# EAGLE design gatedriver_trafo_sma_compact_ACDC_ultra_options (EAGLE 7.2.0)
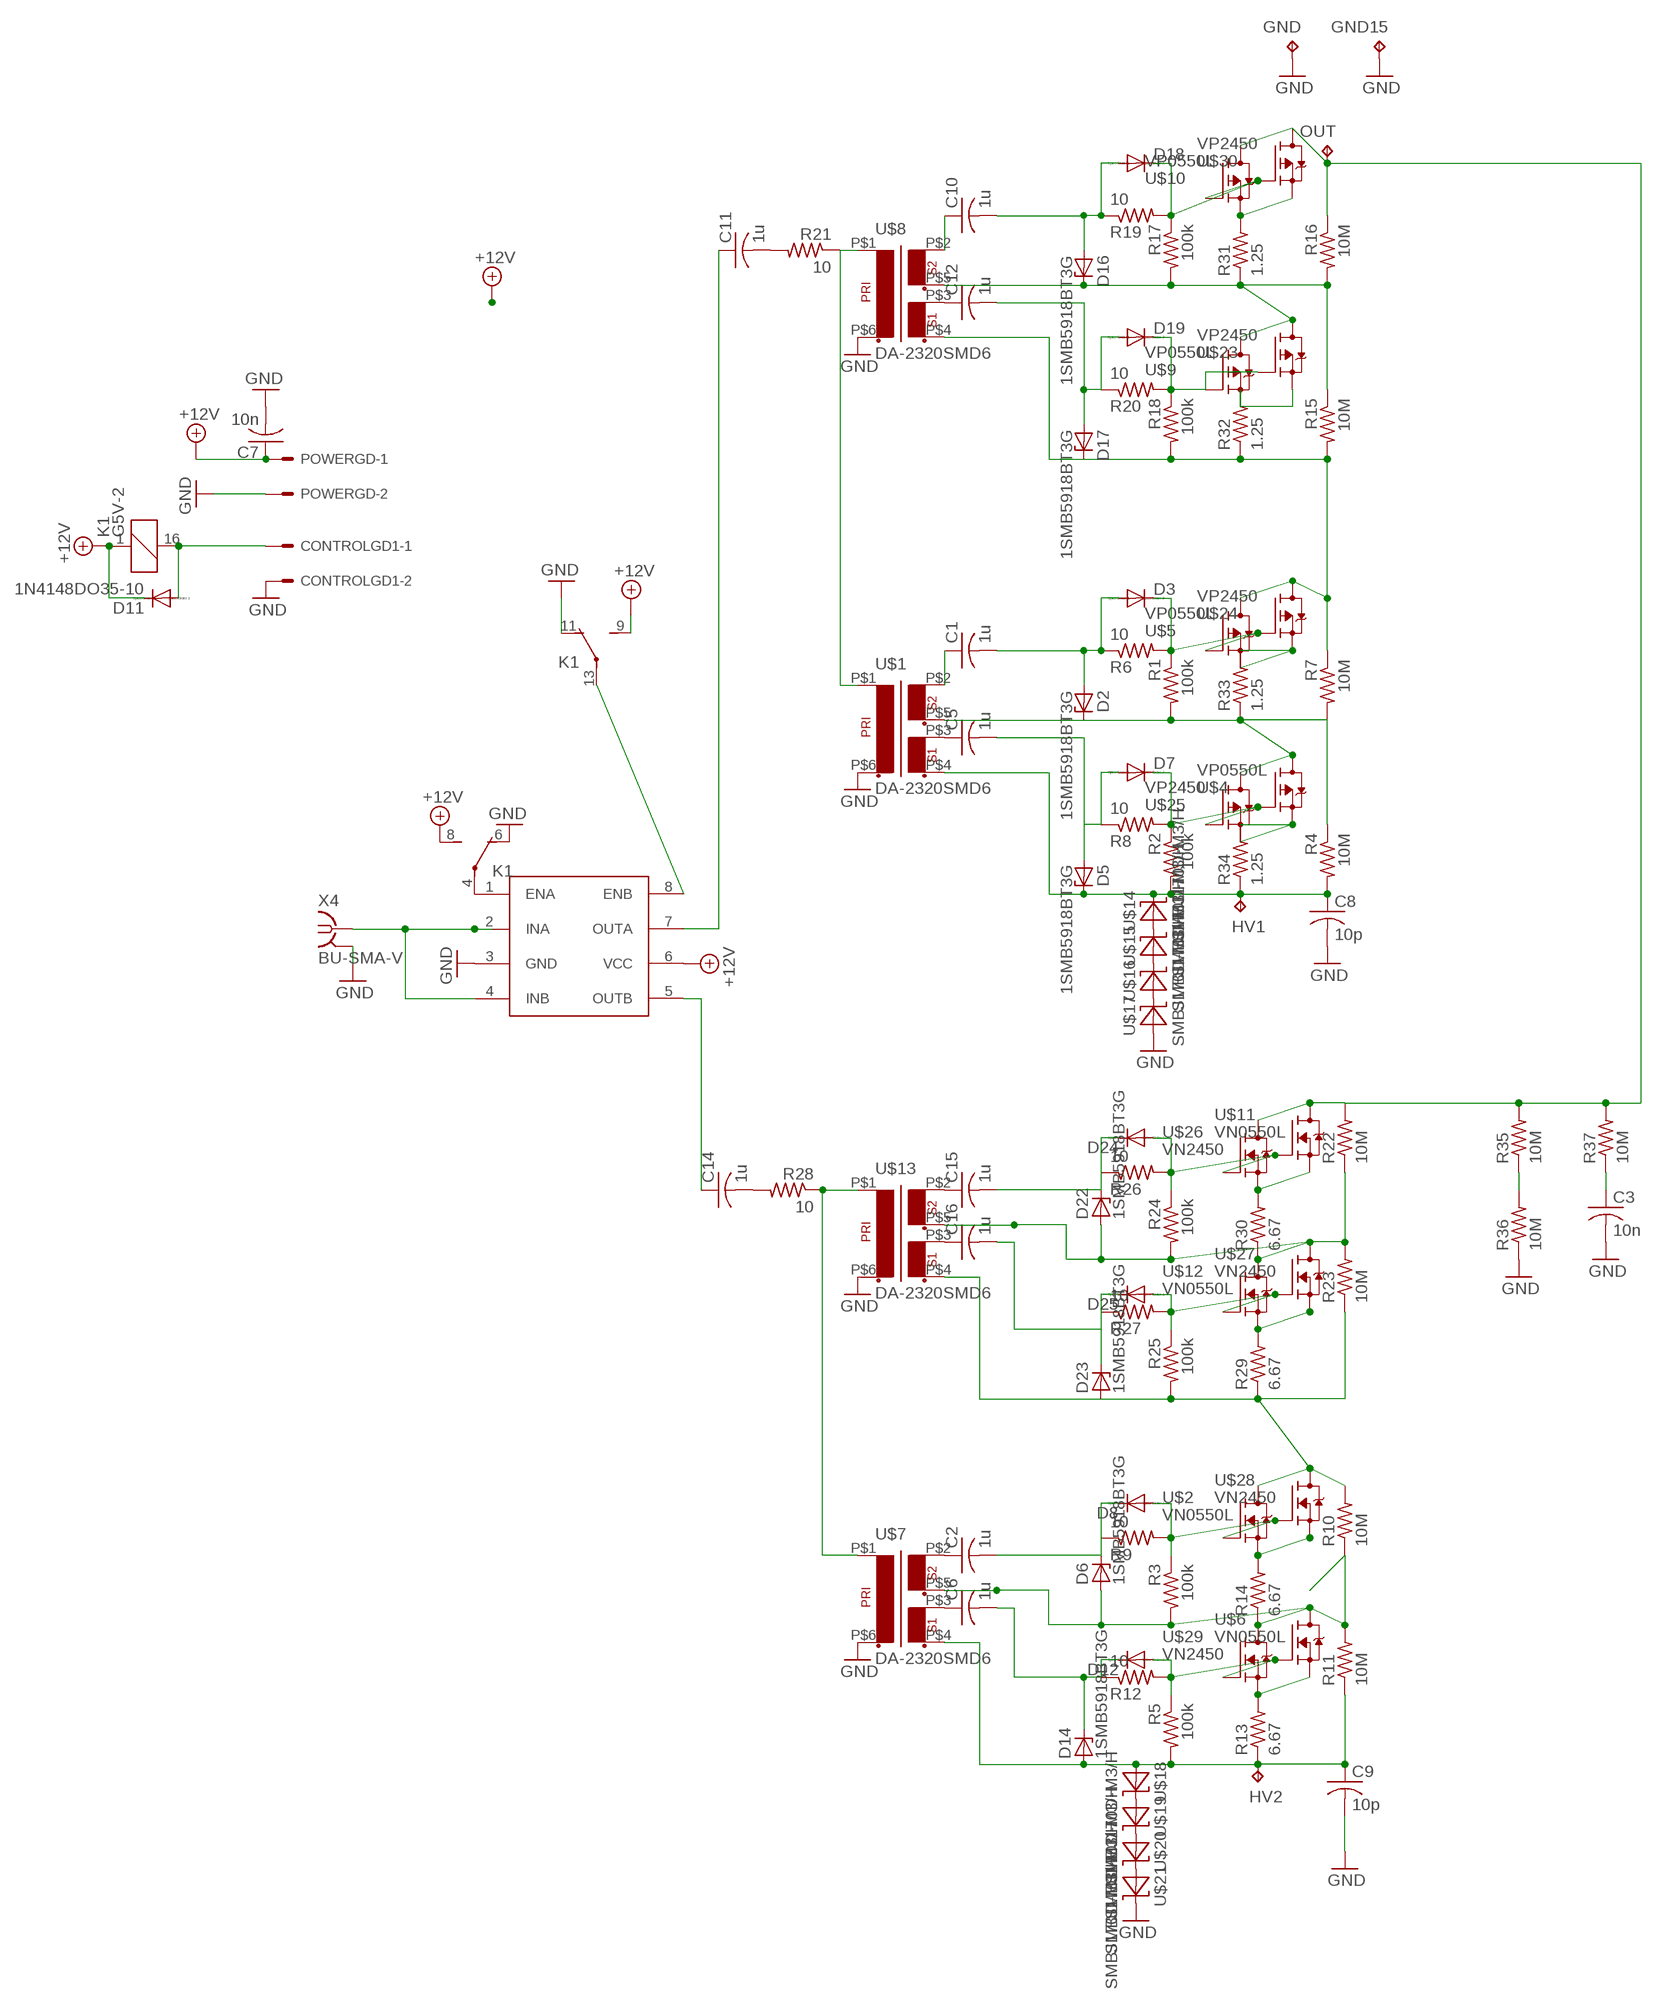
[diagram p0: schematic, sheet 1]

## Parts
C1  1u  C-USC0805  [C0805]
C2  1u  C-USC0805  [C0805]
C3  10n  C-USC0805  [C0805]
C5  1u  C-USC0805  [C0805]
C6  1u  C-USC0805  [C0805]
C7  10n  C-US050-030X075  [C050-030X075]
C8  10p  C-US102-064X133  [C102-064X133]
C9  10p  C-US102-064X133  [C102-064X133]
C10  1u  C-USC0805  [C0805]
C11  1u  C-USC0805  [C0805]
C12  1u  C-USC0805  [C0805]
C14  1u  C-USC0805  [C0805]
C15  1u  C-USC0805  [C0805]
C16  1u  C-USC0805  [C0805]
CONTROLGD1  KK-156-2  [KK-156-2]
D2  1SMB5918BT3G  ZENER-DIODESMB  [SMB]
D3  DIODE-SMB  [SMB]
D5  1SMB5918BT3G  ZENER-DIODESMB  [SMB]
D6  1SMB5918BT3G  ZENER-DIODESMB  [SMB]
D7  DIODE-SMB  [SMB]
D8  DIODE-SMB  [SMB]
D11  1N4148DO35-10  [DO35-10]
D12  DIODE-SMB  [SMB]
D14  1SMB5918BT3G  ZENER-DIODESMB  [SMB]
D16  1SMB5918BT3G  ZENER-DIODESMB  [SMB]
D17  1SMB5918BT3G  ZENER-DIODESMB  [SMB]
D18  DIODE-SMB  [SMB]
D19  DIODE-SMB  [SMB]
D22  1SMB5918BT3G  ZENER-DIODESMB  [SMB]
D23  1SMB5918BT3G  ZENER-DIODESMB  [SMB]
D24  DIODE-SMB  [SMB]
D25  DIODE-SMB  [SMB]
GND  TPPAD1-20Y  [P1-20Y]
GND15  TPPAD1-20Y  [P1-20Y]
HV1  TPPAD1-20Y  [P1-20Y]
HV2  TPPAD1-20Y  [P1-20Y]
K1  G5V-2  [G5V-2]
OUT  TPPAD1-20Y  [P1-20Y]
POWERGD  KK-156-2  [KK-156-2]
R1  100k  R-US_R0805  [R0805]
R2  100k  R-US_R0805  [R0805]
R3  100k  R-US_R0805  [R0805]
R4  10M  R-US_R2512  [R2512]
R5  100k  R-US_R0805  [R0805]
R6  10  R-US_R0805  [R0805]
R7  10M  R-US_R2512  [R2512]
R8  10  R-US_R0805  [R0805]
R9  10  R-US_R0805  [R0805]
R10  10M  R-US_R2512  [R2512]
R11  10M  R-US_R2512  [R2512]
R12  10  R-US_R0805  [R0805]
R13  6.67  R-US_R0805  [R0805]
R14  6.67  R-US_R0805  [R0805]
R15  10M  R-US_R2512  [R2512]
R16  10M  R-US_R2512  [R2512]
R17  100k  R-US_R0805  [R0805]
R18  100k  R-US_R0805  [R0805]
R19  10  R-US_R0805  [R0805]
R20  10  R-US_R0805  [R0805]
R21  10  R-US_R0805  [R0805]
R22  10M  R-US_R2512  [R2512]
R23  10M  R-US_R2512  [R2512]
R24  100k  R-US_R0805  [R0805]
R25  100k  R-US_R0805  [R0805]
R26  10  R-US_R0805  [R0805]
R27  10  R-US_R0805  [R0805]
R28  10  R-US_R0805  [R0805]
R29  6.67  R-US_R0805  [R0805]
R30  6.67  R-US_R0805  [R0805]
R31  1.25  R-US_R0805  [R0805]
R32  1.25  R-US_R0805  [R0805]
R33  1.25  R-US_R0805  [R0805]
R34  1.25  R-US_R0805  [R0805]
R35  10M  R-US_R2512  [R2512]
R36  10M  R-US_R2512  [R2512]
R37  10M  R-US_R2512  [R2512]
U$1  DA-2320SMD6  [SMD6]
U$2  VN0550L  [TO92L]
U$3  UCC27425  [DIL08]
U$4  VP0550L  [TO92L]
U$5  VP0550L  [TO92L]
U$6  VN0550L  [TO92L]
U$7  DA-2320SMD6  [SMD6]
U$8  DA-2320SMD6  [SMD6]
U$9  VP0550L  [TO92L]
U$10  VP0550L  [TO92L]
U$11  VN0550L  [TO92L]
U$12  VN0550L  [TO92L]
U$13  DA-2320SMD6  [SMD6]
U$14  SMBJ170D-M3/H  [DO214AA]
U$15  SMBJ170D-M3/H  [DO214AA]
U$16  SMBJ170D-M3/H  [DO214AA]
U$17  SMBJ170D-M3/H  [DO214AA]
U$18  SMBJ170D-M3/H  [DO214AA]
U$19  SMBJ170D-M3/H  [DO214AA]
U$20  SMBJ170D-M3/H  [DO214AA]
U$21  SMBJ170D-M3/H  [DO214AA]
U$23  VP2450  [SOT89-BCE]
U$24  VP2450  [SOT89-BCE]
U$25  VP2450  [SOT89-BCE]
U$26  VN2450  [SOT89-BCE]
U$27  VN2450  [SOT89-BCE]
U$28  VN2450  [SOT89-BCE]
U$29  VN2450  [SOT89-BCE]
U$30  VP2450  [SOT89-BCE]
X4  BU-SMA-V  [BU-SMA-V]

## Nets
+15V: C7.1 D11.C K1.1 K1.8(1:S) K1.9(2:S) POWERGD.1 U$3.6(VCC) ; supply symbol labelled +12V
ENSW: CONTROLGD1.1 D11.A K1.16
GND: C3.2 C7.2 C8.2 C9.2 CONTROLGD1.2 GND15.TP GND.TP K1.6(1:O) K1.11(2:O) POWERGD.2 R36.1 U$1.P$6 U$3.3(GND) U$7.P$6 U$8.P$6 U$13.P$6 U$17.A U$21.C X4.2 X4.3 X4.4 X4.5
N$1: U$3.2(INA) U$3.4(INB) X4.1
N$2: C11.1 U$3.7(OUTA)
N$3: R13.2 U$6.3(S) U$29.E(S)
N$4: C14.1 U$3.5(OUTB)
N$5: C1.1 U$1.P$2
N$6: R14.2 U$2.3(S) U$28.E(S)
N$7: C5.1 U$1.P$3
N$8: D3.C R1.1 R6.2 U$5.2(G) U$24.B(G)
N$9: R29.2 U$12.3(S) U$27.E(S)
N$10: C1.2 D2.A D3.A R6.1
N$11: D12.A R5.1 R12.2 U$6.2(G) U$29.B(G)
N$12: D7.C R2.1 R8.2 U$4.2(G) U$25.B(G)
N$13: D6.A R3.2 R10.1 R11.2 R14.1 U$6.1(D) U$7.P$5 U$29.C(D) U$29.C@1(D)
N$14: K1.4(1:P) U$3.1(ENA)
N$15: K1.13(2:P) U$3.8(ENB)
N$16: C5.2 D5.A D7.A R8.1
N$17: C8.1 D5.C HV1.TP R2.2 R4.2 R34.1 U$1.P$4 U$14.C
N$18: D2.C R1.2 R4.1 R7.2 R33.1 U$1.P$5 U$4.1(D) U$25.C(D) U$25.C@1(D)
N$19: R30.2 U$11.3(S) U$26.E(S)
N$20: R34.2 U$4.3(S) U$25.E(S)
N$21: R33.2 U$5.3(S) U$24.E(S)
N$22: C2.1 U$7.P$2
N$23: C6.1 U$7.P$3
N$24: C9.1 D14.A HV2.TP R5.2 R11.1 R13.1 U$7.P$4 U$18.A
N$25: C2.2 D6.C D8.C R9.1
N$26: OUT.TP R16.1 R22.2 R35.2 R37.2 U$10.1(D) U$11.1(D) U$26.C(D) U$26.C@1(D) U$30.C(D) U$30.C@1(D)
N$27: C6.2 D12.C D14.C R12.1
N$28: C10.1 U$8.P$2
N$29: C12.1 U$8.P$3
N$30: C12.2 D17.A D19.A R20.1
N$31: R31.2 U$10.3(S) U$30.E(S)
N$32: D17.C R7.1 R15.2 R18.2 R32.1 U$5.1(D) U$8.P$4 U$24.C(D) U$24.C@1(D)
N$33: D16.C R15.1 R16.2 R17.2 R31.1 U$8.P$5 U$9.1(D) U$23.C(D) U$23.C@1(D)
N$34: D18.C R17.1 R19.2 U$10.2(G) U$30.B(G)
N$35: C10.2 D16.A D18.A R19.1
N$36: D19.C R18.1 R20.2 U$9.2(G) U$23.B(G)
N$37: R21.1 U$1.P$1 U$8.P$1
N$38: C11.2 R21.2
N$39: R32.2 U$9.3(S) U$23.E(S)
N$40: C15.1 U$13.P$2
N$41: C16.1 U$13.P$3
N$42: C15.2 D22.C D24.C R26.1
N$43: C16.2 D23.C D25.C R27.1
N$44: R35.1 R36.2
N$45: C3.1 R37.1
N$46: D22.A R22.1 R23.2 R24.2 R30.1 U$12.1(D) U$13.P$5 U$27.C(D) U$27.C@1(D)
N$47: D25.A R25.1 R27.2 U$12.2(G) U$27.B(G)
N$48: R28.1 U$7.P$1 U$13.P$1
N$49: C14.2 R28.2
N$50: D24.A R24.1 R26.2 U$11.2(G) U$26.B(G)
N$51: D23.A R10.2 R23.1 R25.2 R29.1 U$2.1(D) U$13.P$4 U$28.C(D) U$28.C@1(D)
N$52: U$14.A U$15.C
N$53: U$15.A U$16.C
N$54: U$16.A U$17.C
N$55: U$18.C U$19.A
N$56: U$19.C U$20.A
N$57: U$20.C U$21.A
N$251: D8.A R3.1 R9.2 U$2.2(G) U$28.B(G)

## Library data of the parts
C1-C3 C5 C6 C8-C12 C14-C16 = resistor:C-US: CAPACITOR, American symbol
C7 = rcl:C-US: CAPACITOR, American symbol
CONTROLGD1 POWERGD = con-molex:KK-156-2: KK 156 HEADER Source: http://www.molex.com/pdm_docs/sd/026604100_sd.pdf; OC_FARNELL: unknown; OC_NEWARK: unknown
D2 D5 D6 D14 D16 D17 D22 D23 = diode:ZENER-DIODE: Z-Diode
D3 D7 D8 D12 D18 D19 D24 D25 = diode:DIODE-: DIODE
D11 = diode:1N4148: DIODE high speed (Philips)
GND GND15 HV1 HV2 OUT = testpad:TP: Test pad
K1 = relay:G5V-2: OMRON PCB Relay Source: http://www.omron.com/ecb/products/pdf/en-g5v2.pdf; MPN: G5V-2 5DC; OC_FARNELL: 9949488; OC_NEWARK: 78K5703
R1-R37 = rcl:R-US_: RESISTOR, American symbol
U$1 U$7 U$8 U$13 = trafo:DA-2320
U$2 U$6 U$11 U$12 = transistor-fet:VN0550
U$3 = texas:UCC27425
U$4 U$5 U$9 U$10 = transistor-fet:VP0550
U$14-U$21 = diode:SMBJ170D-M3/H
U$23-U$25 U$30 = transistor-fet:VP2450
U$26-U$29 = transistor-fet:VN2450
X4 = con-coax:BU-SMA-V: FEMALE SMA CONNECTOR Radiall distributor RS 112-3794; OC_FARNELL: unknown; OC_NEWARK: unknown

## Board
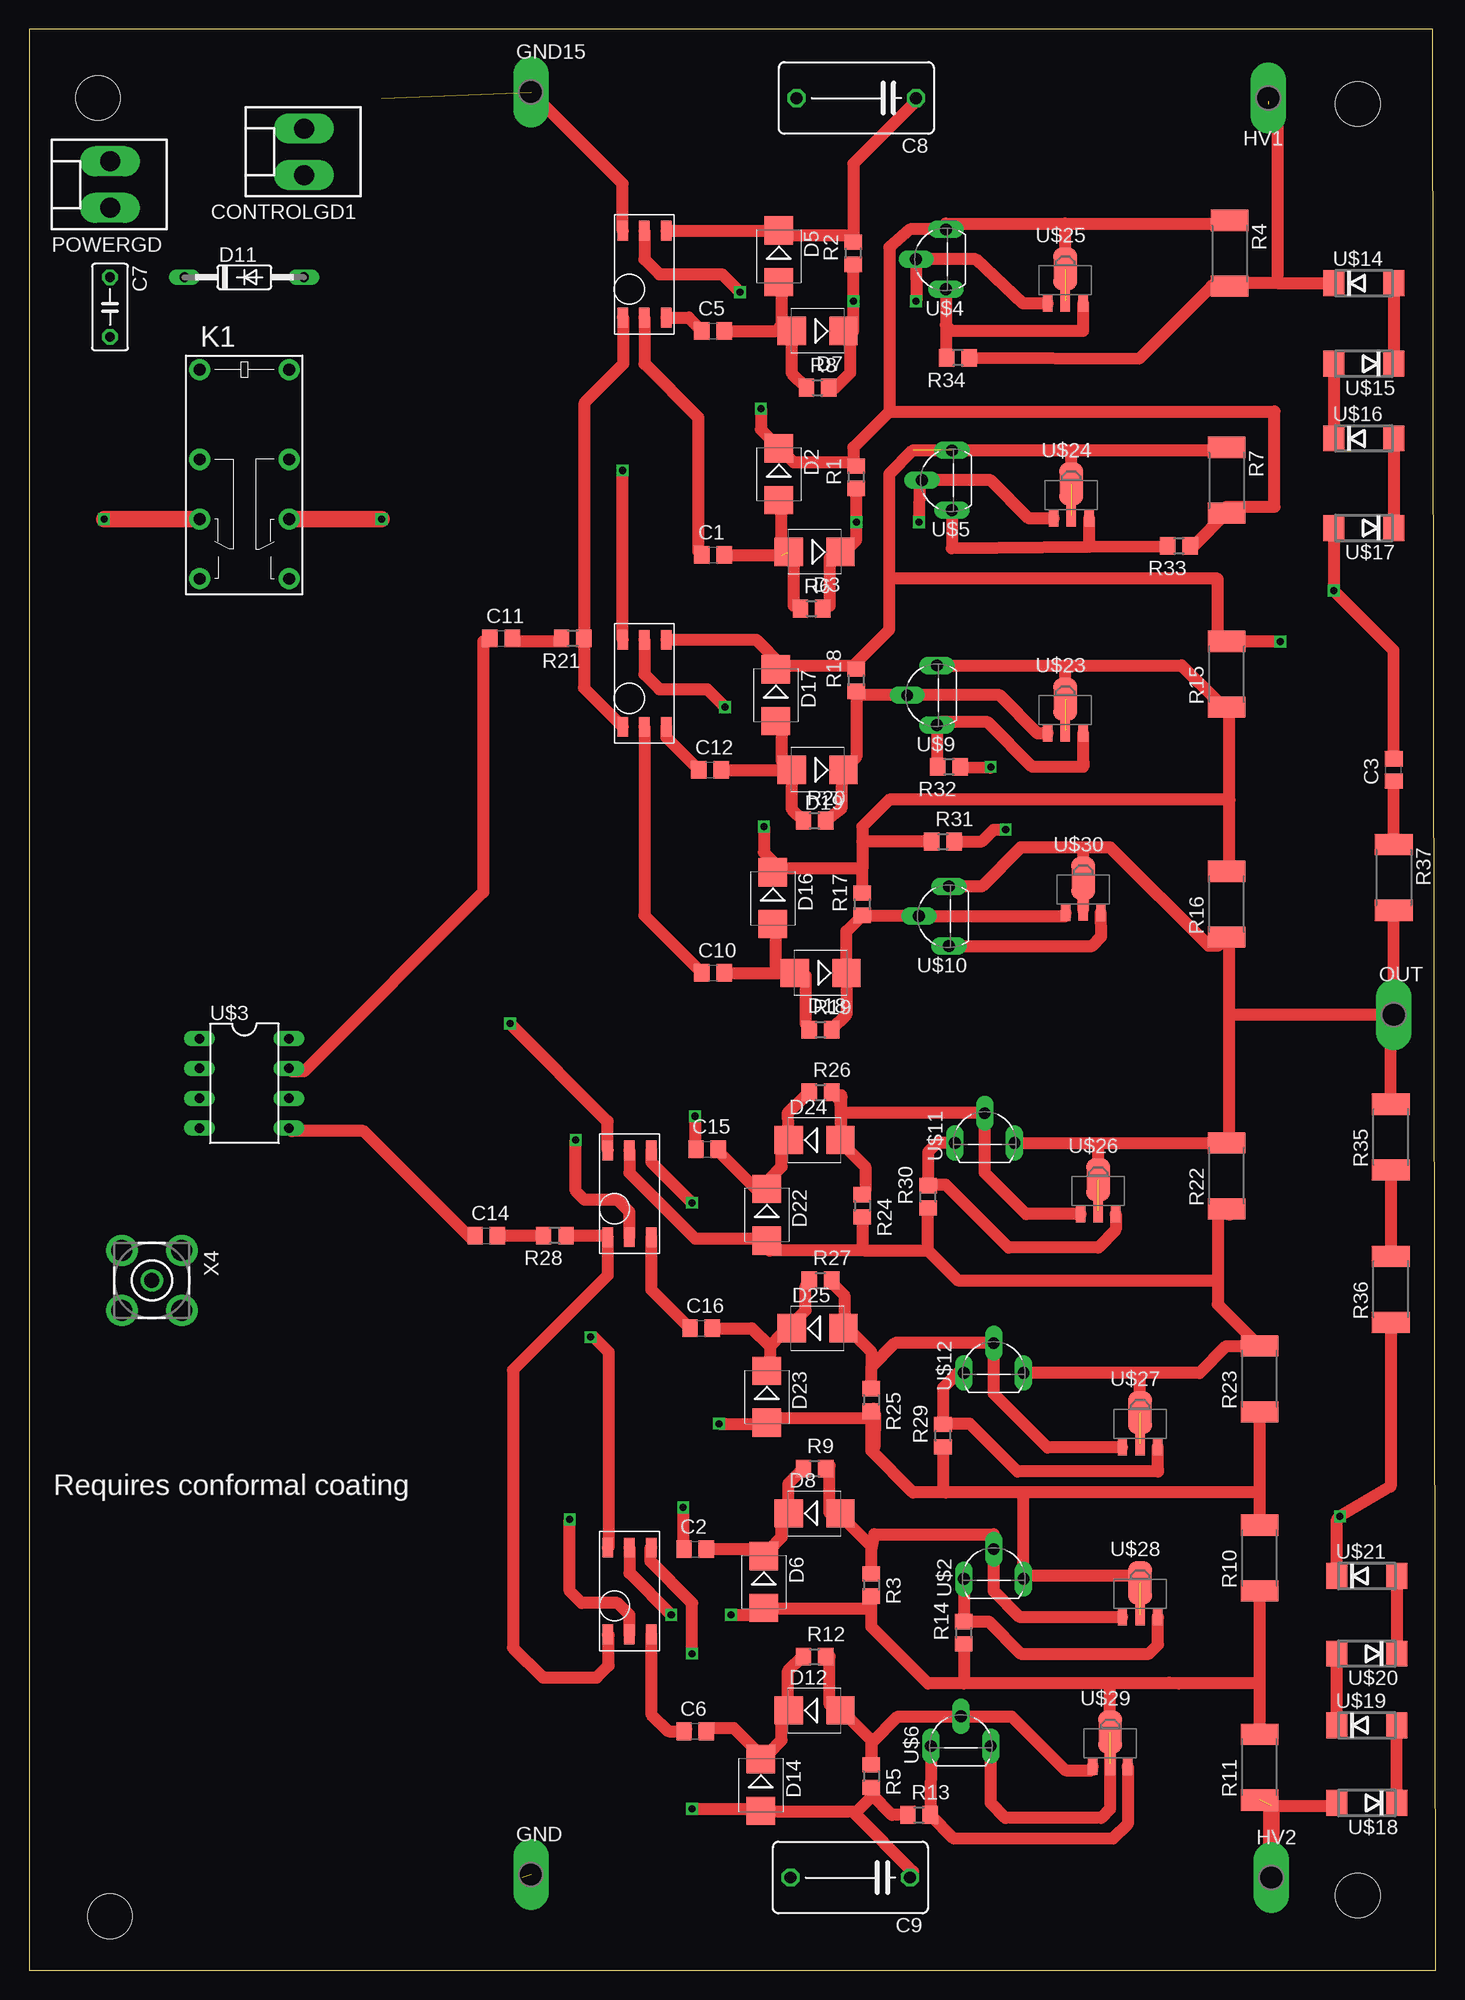
[diagram p1: board, top side]
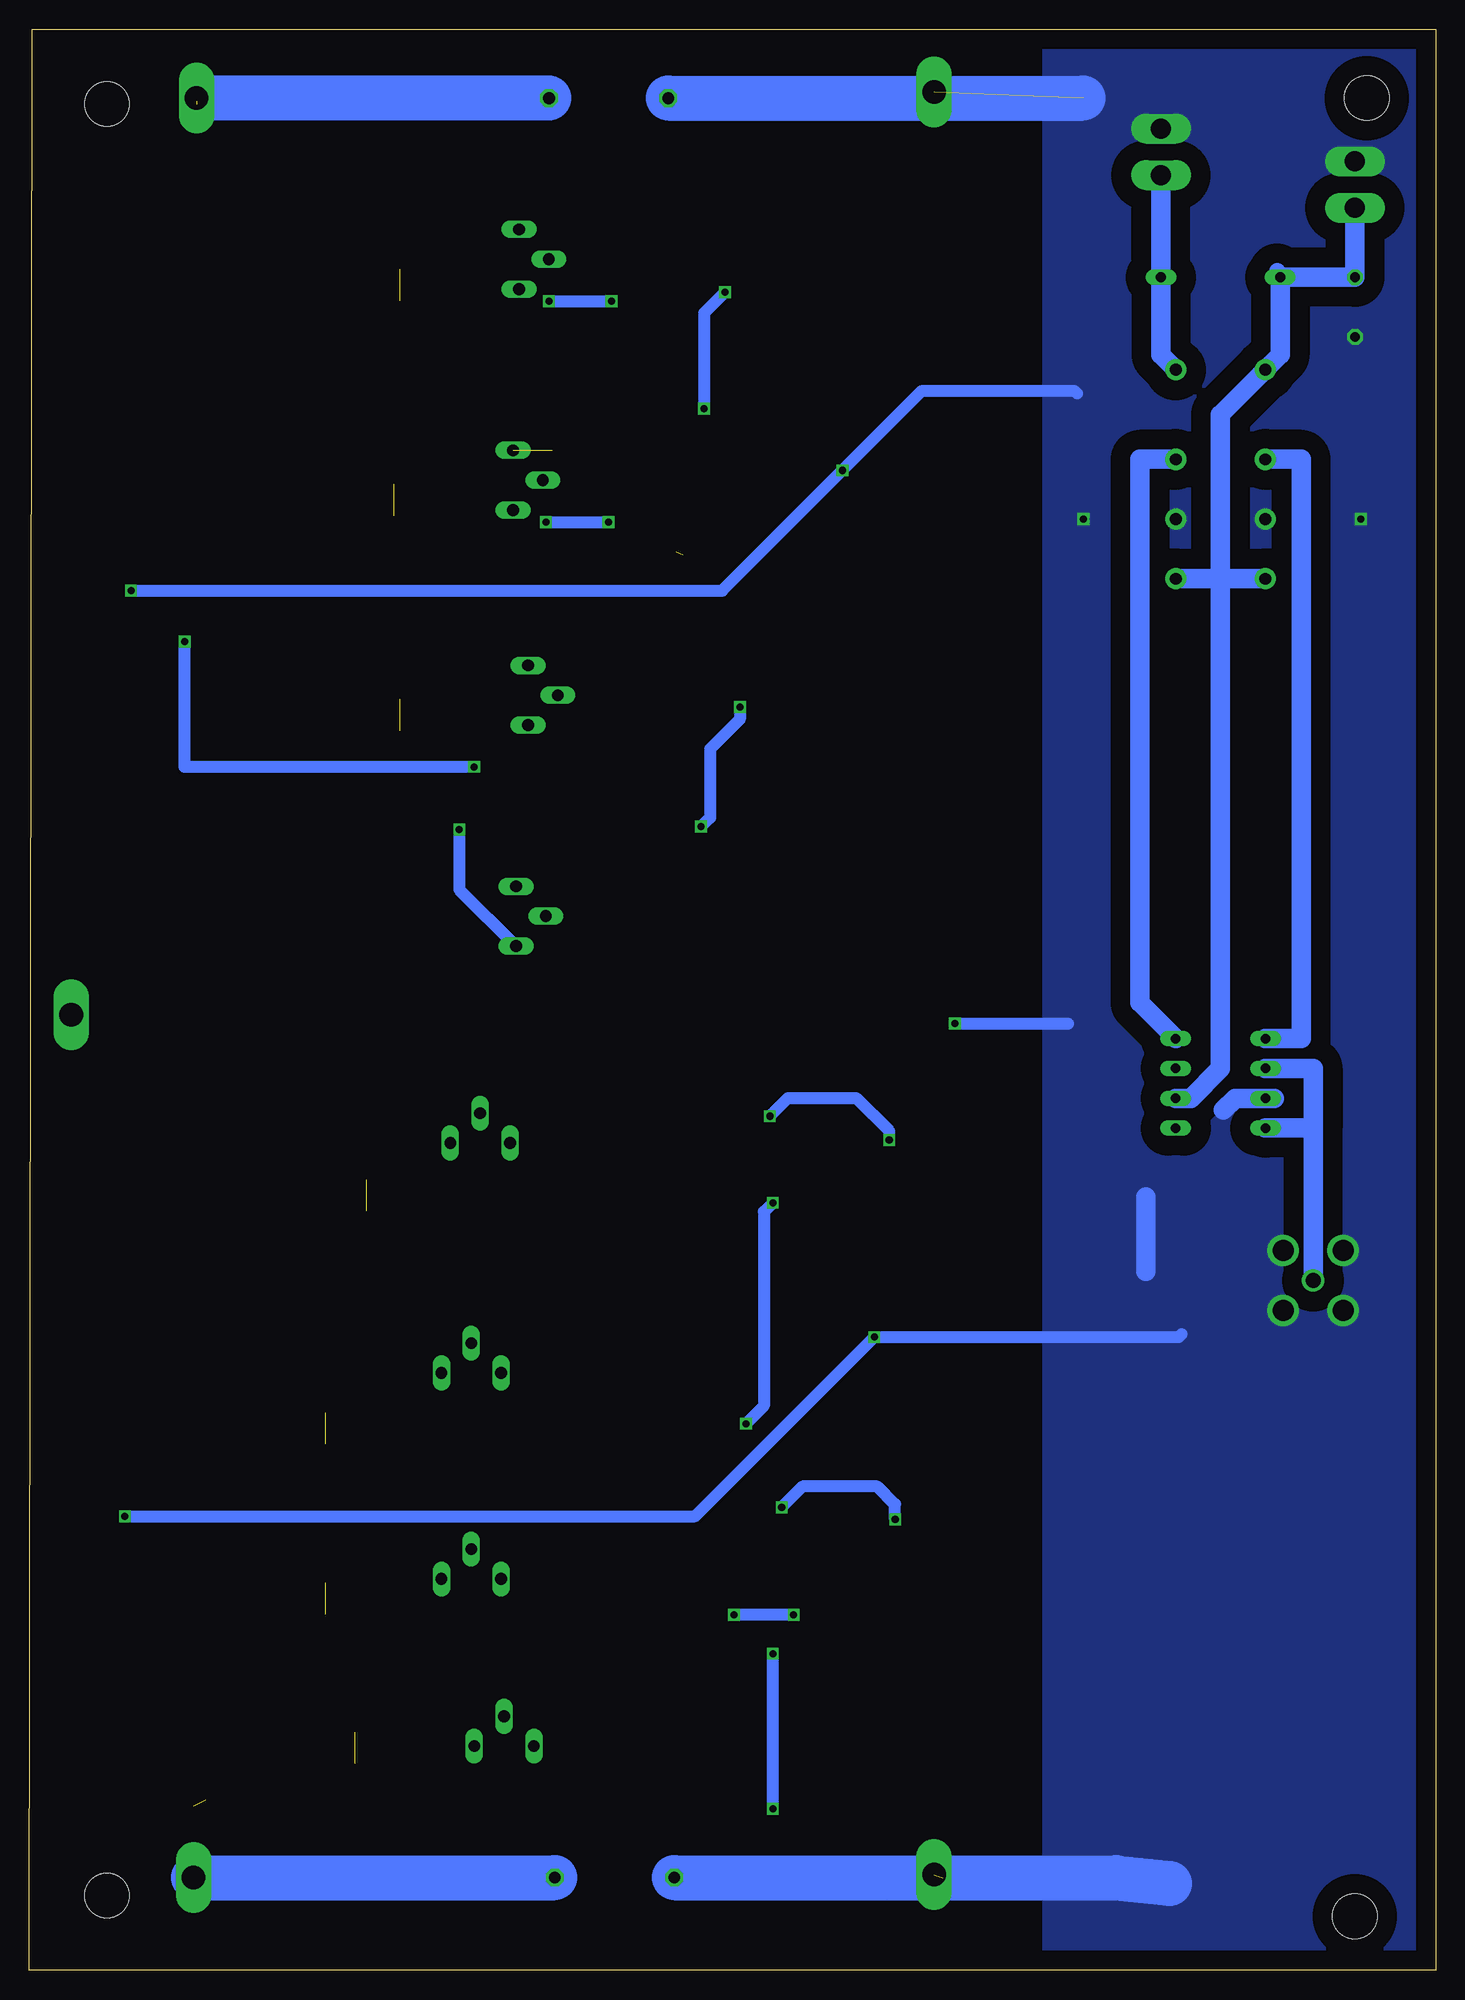
[diagram p2: board, bottom side, seen from below]

Size 119.63 x 165.1 mm. Coordinates in mm from the lower left corner, seen from the top.
Outline: 0,0 119.63,0 119.38,165.1 0,165.1 0,0
Copper layers (1*16): Top 0.035mm / dielectric 1.5mm / Bottom 0.035mm
Design rules "default *": minimum track width 6mil, minimum drill 15mil, track to track 6mil, track to pad 6mil, pad to pad 6mil, via to via 6mil, smd to smd 6mil, copper to edge 40mil, drill to drill 8mil, minimum pad ring 10mil, minimum via ring 8mil, stop-mask expansion 4mil, vias tented up to drill 0mil, thermal gap 10mil
Holes 3.8 mm at 113.03,158.75 113.03,6.35 6.86,4.57 5.84,159.26

### Footprints (pad centres in the part's own frame; a part is rotated, then mirrored left to right if it is on the bottom)
C0805 = smd 1.3 x 1.5: 1 -0.95,0; 2 0.95,0
C050-030X075 = drill 0.813 octagon: 1 -2.54,0; 2 2.54,0
C102-064X133 = drill 1.016 octagon: 1 -5.08,0; 2 5.08,0
KK-156-2 = drill 1.7 pad 2.184 long: 1 -1.98,0; 2 1.98,0
SMB = smd 2.4 x 2.4: A 2.2,0; C -2.2,0
DO35-10 = drill 0.813 long: A 5.08,0; C -5.08,0
P1-20Y = drill 2.007 pad 2.54 long: TP 0,0
G5V-2 = drill 1 pad 1.8: 1 -8.89,-3.81; 4 -1.27,-3.81; 6 3.81,-3.81; 8 8.89,-3.81; 9 8.89,3.81; 11 3.81,3.81; 13 -1.27,3.81; 16 -8.89,3.81
R0805 = smd 1.3 x 1.5: 1 -0.95,0; 2 0.95,0
R2512 = smd 1.8 x 3.2: 1 -2.8,0; 2 2.8,0
SMD6 = smd 1.676 x 0.889: P$1 -3.696,1.854; P$2 -3.696,0; P$3 -3.696,-1.854; P$4 3.696,-1.854; P$5 3.696,0; P$6 3.696,1.854
TO92L = drill 1 long: 1 0,-2.54; 2 2.54,0; 3 0,2.54
DIL08 = drill 0.813 long: 1 -3.81,-3.81; 2 -1.27,-3.81; 3 1.27,-3.81; 4 3.81,-3.81; 5 3.81,3.81; 6 1.27,3.81; 7 -1.27,3.81; 8 -3.81,3.81
DO214AA = smd 1.8 x 2.2: A 2.55,0; C -2.55,0
SOT89-BCE = smd 0.8 x 1.4: B -1.499,-1.981; E 1.499,-1.981 | smd 0.8 x 1.9: C 0,-1.727 | smd 2.032 x 3.65: C@1 0,0.94
BU-SMA-V = drill 1.27: 1 0,0 | drill 1.778: 2 -2.55,2.55; 3 2.55,2.55; 4 2.55,-2.55; 5 -2.55,-2.55

### Placement (x,y rotation side)
C1  58.17,120.4 0 top
C2  56.64,35.81 0 top
C3  116.08,102.11 90 top
C5  58.17,139.45 0 top
C6  56.64,20.32 0 top
C7  6.86,141.48 270 top
C8  70.36,159.26 180 top
C9  69.85,7.87 180 top
C10  58.17,84.84 0 top
C11  40.13,113.28 0 top
C12  57.91,102.11 0 top
C14  38.86,62.48 0 top
C15  57.66,69.85 0 top
C16  57.15,54.61 0 top
CONTROLGD1  23.37,154.69 90 top
D2  63.75,127.25 270 top
D3  66.8,120.65 180 top
D5  63.75,145.8 270 top
D6  62.48,33.02 270 top
D7  67.06,139.45 180 top
D8  66.8,38.86 0 top
D11  18.29,144.02 0 top
D12  66.8,22.1 0 top
D14  62.23,15.75 270 top
D16  63.25,91.19 270 top
D17  63.5,108.46 270 top
D18  67.31,84.84 180 top
D19  67.06,102.11 180 top
D22  62.74,64.26 270 top
D23  62.74,48.77 270 top
D24  66.8,70.61 0 top
D25  67.06,54.61 0 top
GND  42.67,8.13 0 top
GND15  42.67,159.77 0 top
HV1  105.41,159.26 180 top
HV2  105.66,7.87 0 top
K1  18.29,127.25 270 top
OUT  116.08,81.28 0 top
POWERGD  6.86,151.89 90 top
R1  70.36,127 90 top
R2  70.1,146.05 90 top
R3  71.63,32.77 270 top
R4  102.11,146.05 270 top
R5  71.63,16.51 270 top
R6  66.55,115.82 0 top
R7  101.85,126.75 270 top
R8  67.06,134.62 0 top
R9  66.8,42.67 0 top
R10  104.65,35.05 90 top
R11  104.65,17.27 90 top
R12  66.8,26.67 0 top
R13  75.69,13.21 0 top
R14  79.5,28.7 90 top
R15  101.85,110.24 90 top
R16  101.85,90.68 90 top
R17  70.87,90.68 90 top
R18  70.36,109.73 90 top
R19  67.31,80.01 0 top
R20  66.8,97.79 0 top
R21  46.23,113.28 180 top
R22  101.85,67.56 90 top
R23  104.65,50.29 90 top
R24  70.87,65.02 270 top
R25  71.63,48.51 270 top
R26  67.31,74.68 0 top
R27  67.31,58.67 0 top
R28  44.7,62.48 180 top
R29  77.72,45.47 90 top
R30  76.45,65.79 90 top
R31  77.72,96.01 0 top
R32  78.23,102.36 180 top
R33  97.79,121.16 180 top
R34  78.99,137.16 180 top
R35  115.82,70.87 90 top
R36  115.82,57.91 90 top
R37  116.08,92.96 270 top
U$1  52.32,144.27 90 top
U$2  82.04,33.27 90 top
U$3  18.29,75.44 270 top
U$4  77.98,145.54 180 top
U$5  78.49,126.75 180 top
U$6  79.25,19.05 90 top
U$7  51.05,32.26 90 top
U$8  52.32,109.47 90 top
U$9  77.22,108.46 180 top
U$10  78.23,89.66 180 top
U$11  81.28,70.36 90 top
U$12  82.04,50.8 90 top
U$13  51.05,66.04 90 top
U$14  113.54,143.51 0 top
U$15  113.54,136.65 180 top
U$16  113.54,130.3 0 top
U$17  113.54,122.68 180 top
U$18  113.79,14.22 180 top
U$19  113.79,20.83 0 top
U$20  113.79,26.92 180 top
U$21  113.79,33.53 0 top
U$23  88.14,107.19 0 top
U$24  88.65,125.48 0 top
U$25  88.14,143.76 0 top
U$26  90.93,66.29 0 top
U$27  94.49,46.48 0 top
U$28  94.49,32 0 top
U$29  91.95,19.3 0 top
U$30  89.66,91.95 0 top
X4  10.41,58.67 270 top

### Tracks (layer width: path | path; a pad name or v marks a point on that pad's centre or on a via)
+15V
  Bottom 1.016: 13.21,144.53 D11.C
  Bottom 1.422: 13.46,144.02 13.46,144.53
  Bottom 1.676: D11.C 13.21,137.41 K1.1 18.29,132.33 18.29,118.36 | 18.29,118.36 18.29,76.71 20.83,74.17 U$3.6 | 18.29,118.36 K1.9 | K1.8 18.29,118.36 | POWERGD.1 C7.1 D11.C | D11.C 13.46,144.02
ENSW
  Bottom 1.676: CONTROLGD1.1 D11.A 23.37,137.41 K1.16
GND  (via drill 0.6)  (2 unrouted)
  Top 1.016: v47.75,53.85 48.01,53.85 49.28,52.58 49.28,36.03 U$7.P$6 | U$1.P$6 50.47,151.97 GND15.TP | U$8.P$6 v50.47,127.58 | U$13.P$6 49.2,72.21 v40.89,80.52 | 111.25,33.54 U$21.C 111.24,38.34 v111.51,38.61 115.82,41.15 R36.1 | U$17.A v110.99,117.36 116.08,112.27 C3.2
  Top 1.422: K1.6 v6.35,123.44 | K1.11 v29.97,123.44
  Bottom 1.016: 15.24,74.17 15.24,74.42 U$3.3 | 21.59,54.1 21.84,53.85 v47.75,53.85 62.99,38.61 v111.51,38.61 | 30.48,134.11 30.73,134.37 43.69,134.37 v50.47,127.58 60.71,117.35 106.17,117.35 v110.99,117.36 | v40.89,80.52 31.24,80.52
  Bottom 1.422: 41.66,8.13 41.91,7.87
  Bottom 1.676: 24.64,65.79 24.64,59.44 | 18.03,73.15 17.02,74.17 15.24,74.17 U$3.3 13.72,74.17
  Bottom 3.81: 46.69,7.82 27.18,7.85 | 27.18,7.85 22.61,7.37 | C8.2 29.97,159.26 | C9.2 41.91,7.87 27.18,7.87 27.18,7.85
  pour Bottom (isolate 1.676, no thermals): 0,165.1 33.27,165.1 33.27,0 0,0
N$1
  Bottom 1.676: X4.1 10.41,71.63 | U$3.2 10.41,76.71 10.41,71.63 | 10.41,71.63 U$3.4
N$2
  Top 1.016: U$3.7 22.35,76.45 23.37,76.45 38.61,91.69 38.61,113.03 C11.1
N$3
  Top 1.016: U$6.3 R13.2 78.67,11.18 92.2,11.18 93.45,12.42 U$29.E
N$4
  Top 1.016: U$3.5 22.35,71.37 28.45,71.37 37.59,62.23 C14.1
N$5
  Top 1.016: U$1.P$2 52.32,136.65 56.9,132.08 56.9,120.72 C1.1
N$6
  Top 1.016: U$2.3 R14.2 81.6,29.65 84.33,26.92 95.25,26.92 96.01,27.69 96.01,30 U$28.E
N$7
  Top 1.016: U$1.P$3 56.09,140.58 C5.1
N$8  (via drill 0.6)
  Top 1.016: R6.2 68.07,116.08 68.07,120.14 D3.C 69.34,120.65 70.36,121.67 v70.36,123.19 R1.1 | v75.69,123.19 75.72,126.77 U$5.2 81.79,126.75 85.04,123.5 U$24.B
  Bottom 1.016: v75.69,123.19 v70.36,123.19
N$9
  Top 1.016: U$12.3 78.99,50.8 77.72,49.53 R29.2 77.79,46.48 80.01,46.48 84.07,42.42 96.01,42.42 95.99,42.95 U$27.E
N$10  (1 unrouted)
  Top 1.016: R6.1 65.02,116.08 65.02,120.14 D3.A 64.01,121.16 64.01,124.21 D2.A | C1.2 64.01,120.4
N$11
  Top 1.016: R12.2 68.07,26.67 68.07,22.61 D12.A 69.09,22.1 71.63,19.56 R5.1 71.63,19.3 73.91,21.59 U$6.2 83.57,21.59 88.14,17.02 90.4,17.02 U$29.B
N$12  (via drill 0.6)
  Top 1.016: R2.1 v70.1,141.99 70.1,139.45 69.85,139.45 | 69.85,139.45 D7.C | R8.2 68.58,134.62 69.85,135.89 69.85,139.45 | v75.44,141.99 75.46,142.01 U$4.2 80.52,145.54 84.53,141.78 U$25.B
  Bottom 1.016: v75.44,141.99 v70.1,141.99
N$13  (via drill 0.6)  (1 unrouted)
  Top 1.016: 71.63,30.73 62.74,30.73 D6.A 62.65,30.23 v59.69,30.23 | 71.63,30.73 71.63,29.21 76.45,24.38 79.5,24.38 | 104.65,24.38 97.79,24.38 | 97.79,24.38 91.95,24.38 | 91.95,24.38 79.5,24.38 | 104.65,24.38 R11.2 | R11.2 | R10.1 104.65,24.38 | U$7.P$5 51.05,33.78 v54.61,30.23 | R11.2 | 96.96,24.45 97.79,24.38 | R14.1 79.5,24.38 | U$6.1 81.79,14.22 83.06,12.95 91.19,12.95 91.95,13.72 U$29.C@1 91.95,24.38 | 71.63,30.73 R3.2
  Bottom 1.016: v54.61,30.23 v59.69,30.23
N$14
  Bottom 1.676: 13.97,79.25 U$3.1 11.43,79.25 11.43,128.52 K1.4
N$15
  Bottom 1.676: K1.13 25.15,128.52 25.15,82.3 U$3.8
N$16
  Top 1.016: 64.01,139.95 64.01,143.51 D5.A | 64.01,139.95 64.01,139.45 D7.A 64.86,135.87 R8.1 | C5.2 63.5,139.45 64.01,139.95
N$17  (1 unrouted)
  Top 1.016: 106.17,143.51 102.11,143.51 R4.2 100.58,143.26 94.42,137.09 R34.1 | 70.1,147.57 64.01,147.57 D5.C 63.73,147.97 U$1.P$4 | 70.1,147.57 70.1,153.67 75.18,158.75 C8.1 | 70.1,147.57 R2.2 | 106.17,143.51 106.17,158.24 105.41,158.75 | 106.17,143.51 U$14.C
  Bottom 1.016: 104.9,159.26 105.16,159.77 HV1.TP 105.41,159
  Bottom 3.81: C8.1 104.9,159.26
N$18  (via drill 0.6)  (1 unrouted)
  Top 1.016: R7.2 102.11,124.46 105.92,124.46 105.92,132.59 73.15,132.59 | 70.1,128.27 65.02,128.27 64.01,129.29 | 64.01,129.29 D2.C | 88.14,148.59 77.98,148.59 U$4.1 74.93,148.08 73.15,146.56 73.15,132.59 | 88.14,148.59 102.11,148.59 R4.1 | 70.1,128.27 70.1,129.54 73.15,132.59 | 70.1,128.27 R1.2 | 100.81,124.23 101.85,124.21 101.85,124.46 R7.2 | U$1.P$5 52.32,145.54 53.59,144.27 58.93,144.27 v60.45,142.75 | v62.23,132.84 62.23,131.06 64.01,129.29 | R33.1 99.07,121.16 R7.2 | U$25.C@1 88.14,148.59
  Bottom 1.016: v60.45,142.75 62.23,140.97 v62.23,132.84
N$19
  Top 1.016: U$11.3 77.22,70.36 76.45,69.6 R30.2 76.52,66.8 77.98,66.8 83.31,61.47 90.93,61.47 92.43,63.02 U$26.E
N$20
  Top 1.016: U$4.3 77.98,139.95 | 77.98,139.95 77.98,137.48 R34.2 | U$25.E 89.64,139.47 89.66,139.45 78.49,139.45 77.98,139.95
N$21
  Top 1.016: U$5.3 78.49,120.97 90.18,121.09 | 90.18,121.09 R33.2 | U$24.E 90.14,121.12 90.18,121.09
N$22  (via drill 0.6)
  Top 1.016: 55.63,35.75 C2.1 55.63,35.88 v55.63,39.37 | U$7.P$2 51.05,30.23 50.04,31.24 46.99,31.24 45.97,32.26 v45.97,38.35
  Bottom 1.016: v45.97,38.35 45.97,39.62 47.5,41.15 53.85,41.15 v55.63,39.37
N$23
  Top 1.016: 55.88,20.51 C6.1 54.36,20.32 52.91,21.77 U$7.P$3
N$24  (via drill 0.6)  (1 unrouted)
  Top 1.016: 103.89,14.48 R11.1 | 70.23,13.34 75.18,8.38 C9.1 | 70.23,13.34 70.1,13.46 62.99,13.46 62.74,13.49 | 62.74,13.49 D14.A | v56.39,13.72 62.52,13.72 62.74,13.49 | 71.69,15.49 R5.2 71.63,14.99 | 71.63,14.99 71.63,14.73 70.23,13.34 | v56.39,26.92 56.39,31.24 52.83,34.8 52.83,35.88 U$7.P$4 | R13.1 73.41,13.21 71.63,14.99 | 105.66,13.97 110.99,13.97 U$18.A
  Top 1.422: HV2.TP 105.66,13.97
  Bottom 1.016: 106.17,7.87 HV2.TP | v56.39,13.72 v56.39,26.92
  Bottom 1.676: 105.66,7.62 HV2.TP
  Bottom 3.81: HV2.TP C9.1
N$25
  Top 1.016: C2.2 61.98,35.81 D6.C 62.99,35.81 64.01,36.83 64.01,38.86 D8.C 64.6,41.42 R9.1
N$26  (1 unrouted)
  Top 1.016: 102.11,81.28 102.11,70.36 R22.2 101.09,70.36 90.93,70.36 | 102.11,81.28 102.11,87.63 R16.1 101.1,87.12 100.33,87.12 91.95,95.5 89.66,95.5 | 102.11,81.28 OUT.TP | U$11.1 90.93,70.36 | R35.2 115.82,81.03 OUT.TP | OUT.TP R37.2 | 89.66,95.5 84.33,95.5 81.03,92.2 U$10.1 | U$30.C U$30.C@1 89.66,95.5 | U$26.C@1 90.93,70.36
N$27
  Top 1.016: C6.2 57.91,20.57 59.94,20.57 61.98,18.54 D14.C 62.99,18.54 64.01,19.56 64.01,21.59 D12.C 64.52,22.18 64.52,25.4 65.79,26.67 R12.1
N$28
  Top 1.016: U$8.P$2 52.32,89.73 C10.1
N$29
  Top 1.016: U$8.P$3 54.18,104.89 C12.1
N$30
  Top 1.016: 64.39,102.53 64.01,102.87 64.01,105.92 D17.A | 64.39,102.53 D19.A 64.86,98.79 R20.1 | C12.2 63.97,102.11 64.39,102.53
N$31  (via drill 0.6)
  Top 1.016: U$10.3 90.42,87.12 91.19,87.91 U$30.E | R31.2 81.03,96.01 82.04,97.03 v83.06,97.03
  Bottom 1.016: v83.06,97.03 83.06,91.95 U$10.3
N$32  (via drill 0.6)  (2 unrouted)
  Top 1.016: 88.9,129.29 75.18,129.29 73.15,127.25 73.15,118.36 | 88.9,129.29 101.85,129.29 R7.1 | 64.01,111 70.1,111 | 64.01,111 D17.C | v106.43,113.03 102.11,113.03 R15.2 101.09,113.03 101.09,118.36 73.15,118.36 | 70.1,111 73.15,114.05 73.15,118.36 | 70.1,111 R18.2 | U$8.P$4 61.84,113.17 64.01,111 | R32.1 81.72,102.3 v81.79,102.36 | U$24.C@1 88.65,129.03 88.9,129.29
  Bottom 1.016: v106.43,113.03 106.43,102.36 v81.79,102.36
N$33  (via drill 0.6)  (1 unrouted)
  Top 1.016: U$9.1 88.14,111 | 88.14,111 98.04,111 101.09,107.95 R15.1 102.11,106.93 102.11,99.57 | 70.87,93.73 64.01,93.73 63.89,93.67 | 102.11,99.57 73.15,99.57 70.87,97.28 70.87,96.01 | 63.89,93.67 D16.C | 102.11,99.57 102.11,93.73 R16.2 | R17.2 70.87,93.73 | U$8.P$5 52.32,110.24 53.59,108.97 57.66,108.97 v59.18,107.44 | v62.48,97.28 62.48,95.08 63.89,93.67 | 70.87,96.01 70.87,93.73 | R31.1 70.87,96.01 | U$23.C@1 88.14,111
  Bottom 1.016: v59.18,107.44 59.18,106.43 61.72,103.89 61.72,98.04 v62.48,97.28
N$34
  Top 1.016: R19.2 69.51,81.26 D18.C 69.51,88.37 R17.1 75.7,89.73 U$10.2 88.11,89.66 U$30.B
N$35
  Top 1.016: R19.1 66.04,80.52 66.04,84.58 D18.A 63.5,84.84 | 63.5,84.84 63.5,88.9 D16.A | C10.2 63.5,84.84
N$36
  Top 1.016: R20.2 69.09,98.81 69.09,101.85 D19.C 70.36,103.21 70.36,108.46 | R18.1 70.36,108.46 | 70.36,108.46 U$9.2 82.55,108.46 85.8,105.21 U$23.B
N$37
  Top 1.016: U$8.P$1 47.18,109.07 R21.1 47.24,113.28 47.24,133.35 50.55,136.65 50.55,140.5 U$1.P$1
N$38
  Top 1.016: C11.2 41.66,113.03 44.7,113.03 R21.2
N$39
  Top 1.016: R32.2 77.22,102.43 U$9.3 77.47,106.17 81.53,106.17 85.34,102.36 89.66,102.36 89.64,103.4 U$23.E
N$40  (via drill 0.6)
  Top 1.016: U$13.P$2 51.05,64.52 50.04,65.53 47.24,65.53 46.48,66.29 v46.48,70.61 | v56.64,72.64 56.64,69.92 C15.1
  Bottom 1.016: v46.48,70.61 46.48,71.37 49.28,74.17 55.12,74.17 v56.64,72.64
N$41
  Top 1.016: U$13.P$3 52.91,57.9 C16.1
N$42
  Top 1.016: R26.1 66.04,74.42 64.52,72.9 D24.C 64.01,70.36 64.01,68.33 62.99,67.31 D22.C 61.98,66.29 58.93,69.34 C15.2
N$43
  Top 1.016: R27.1 66.04,58.17 66.04,56.13 65.02,55.12 D25.C 64.01,54.1 62.99,53.09 | 62.99,53.09 62.99,51.05 D23.C | C16.2 61.47,54.61 62.99,53.09
N$44
  Top 1.016: R35.1 R36.2
N$45
  Top 1.016: R37.1 C3.1
N$46  (1 unrouted)
  Top 1.016: 71.12,61.21 62.99,61.21 D22.A 62.57,62.23 56.64,62.23 51.05,67.82 U$13.P$5 | 101.09,58.67 101.09,64.26 R22.1 102.11,64.26 | 101.09,58.67 101.09,56.64 104.27,53.47 | 104.27,53.47 R23.2 | 70.93,64.01 R24.2 70.87,61.47 71.12,61.21 | 104.27,53.47 103.89,53.09 101.85,53.09 99.57,50.8 94.74,50.8 | 71.12,61.21 76.45,61.21 | 76.45,61.21 R30.1 | 76.45,61.21 78.99,58.67 101.09,58.67 | 94.74,50.8 U$12.1 | U$27.C@1 94.49,50.55 94.74,50.8
N$47
  Top 1.016: 71.63,51.31 71.63,52.58 70.1,54.1 D25.A 69.34,54.7 69.34,57.4 68.26,58.49 R27.2 | R25.1 71.63,51.31 | 71.63,51.31 73.66,53.34 U$12.2 82.04,49.02 86.61,44.45 92.94,44.45 U$27.B
N$48
  Top 1.016: R28.1 49.06,62.48 U$13.P$1 49.2,59.11 41.15,51.05 41.15,27.43 43.69,24.89 48.26,24.89 49.28,25.91 49.28,28.49 U$7.P$1
N$49
  Top 1.016: C14.2 R28.2
N$50
  Top 1.016: R24.1 71.12,66.29 71.12,68.33 69.09,70.36 | 69.09,70.36 D24.A 69,73.66 69.09,74.42 | 69.09,70.36 69.09,72.9 | 69.09,72.9 69.09,73.85 R26.2 | 69.09,72.9 U$11.2 81.28,67.82 84.78,64.31 U$26.B
N$51  (via drill 0.6)  (1 unrouted)
  Top 1.016: R25.2 71.12,46.99 62.99,46.99 D23.A 62.65,46.48 v58.67,46.48 | R23.1 104.65,40.64 | 104.65,40.64 R10.2 | 104.65,40.64 84.33,40.64 | 84.33,40.64 77.98,40.64 | 77.98,40.64 75.18,40.64 71.63,44.2 R25.2 | 71.82,47.75 R25.2 | U$13.P$4 52.91,68.76 v56.39,65.28 | R25.2 71.95,47.24 71.88,44.45 | R29.1 77.72,40.89 77.98,40.64 | U$28.C@1 94.49,33.53 84.84,33.53 U$2.1 84.58,40.39 84.33,40.64
  Bottom 1.016: v56.39,65.28 57.15,64.52 57.15,48.01 v58.67,46.48
N$52
  Top 1.016: U$14.A U$15.C
N$53
  Top 1.016: U$15.A U$16.C
N$54
  Top 1.016: U$16.A U$17.C
N$55
  Top 1.016: U$18.C U$19.A
N$56
  Top 1.016: U$19.C U$20.A
N$57
  Top 1.016: U$21.A 116.09,33.01 116.33,32.77 116.33,26.93 U$20.C
N$251
  Top 1.016: R9.2 68.07,42.93 68.07,38.86 D8.A 69,38.69 71.63,36.07 71.63,35.81 | R3.1 71.63,35.81 | 71.63,35.81 71.88,37.08 82.04,37.08 U$2.2 82.04,32.26 84.28,30.02 U$28.B

### Text on the board
tPlace: Requires conformal coating